# EAGLE design MATRIZ 8x8 (EAGLE 6.4)
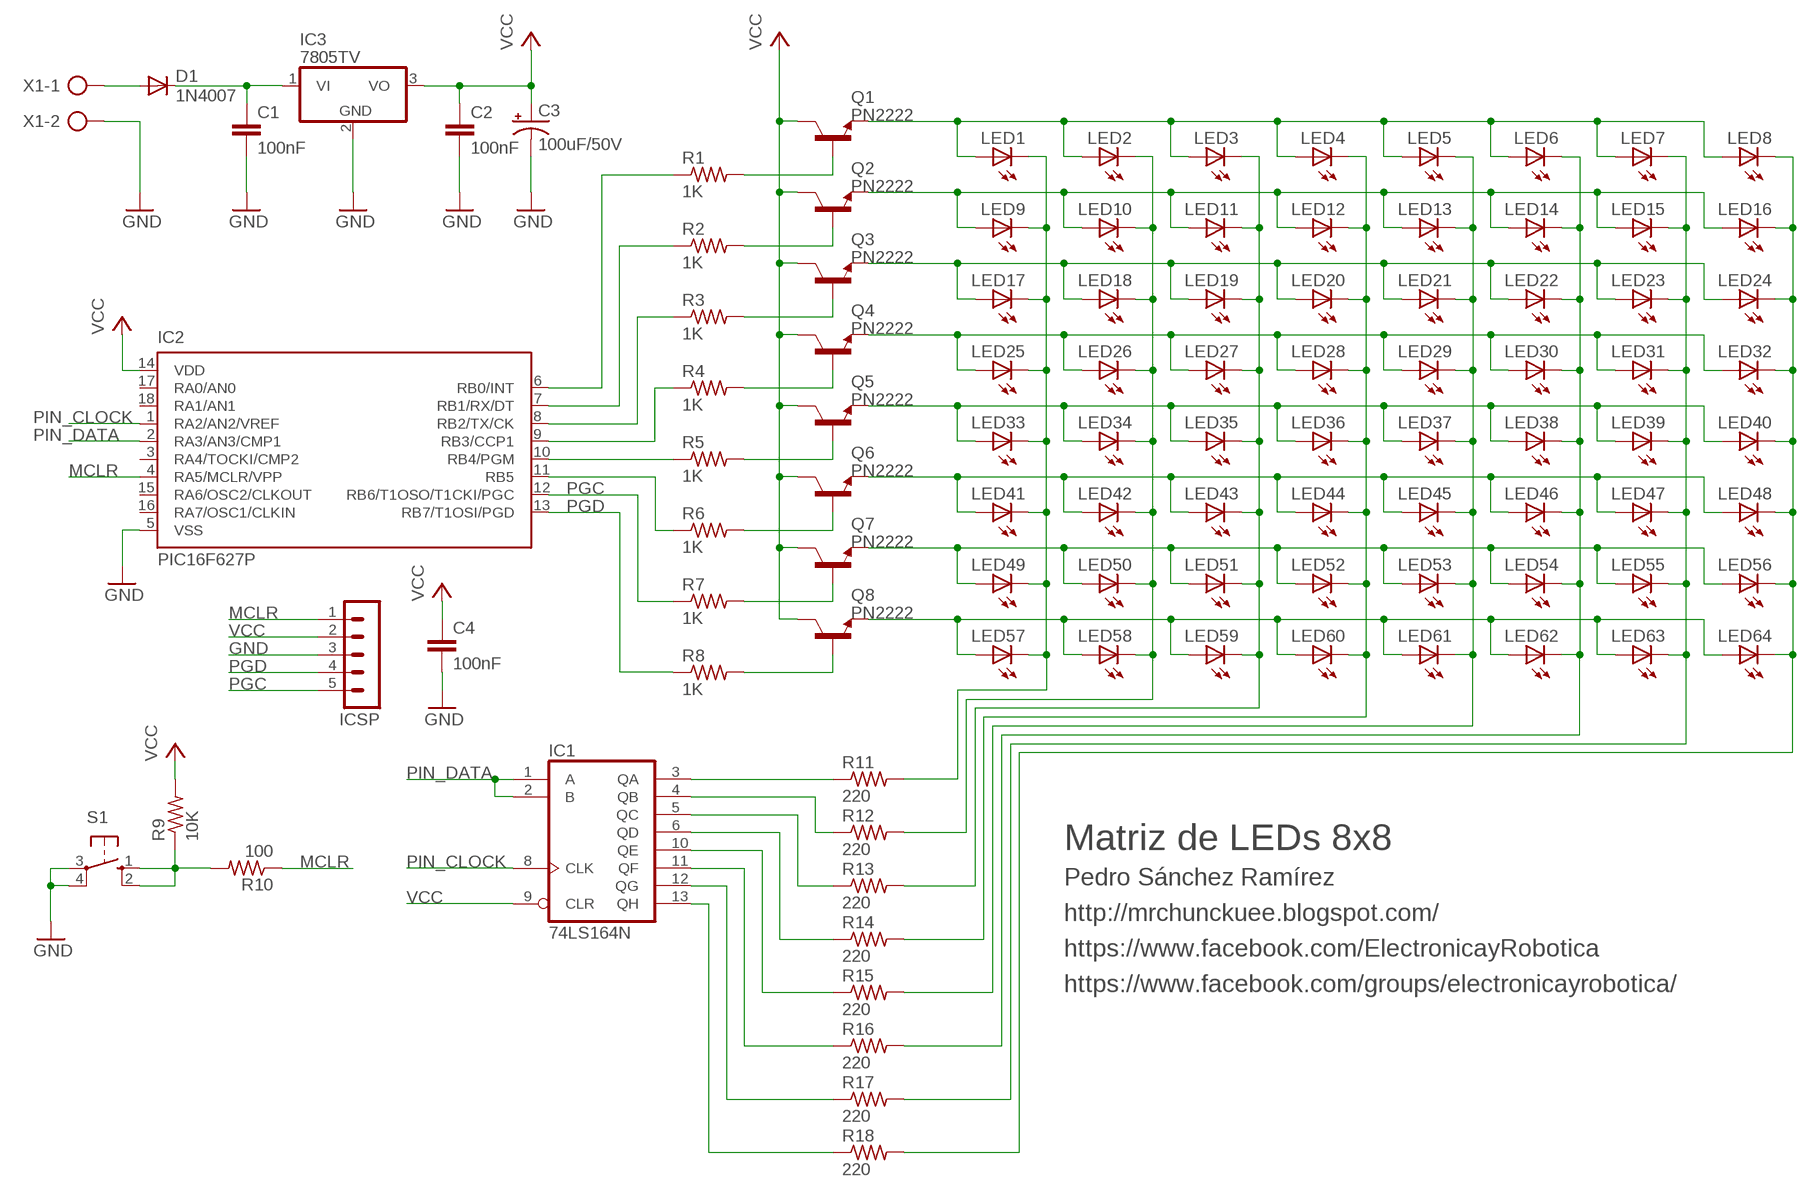
[diagram p0: schematic, sheet 1]

## Parts
C1  100nF  C-EU050-024X044  [C050-024X044]
C2  100nF  C-EU050-024X044  [C050-024X044]
C3  100uF/50V  CPOL-USE5-10.5  [E5-10,5]
C4  100nF  C-EU050-024X044  [C050-024X044]
D1  1N4007  1N4004  [DO41-10]
IC1  74LS164N  [DIL14]
IC2  PIC16F627P  [DIL18]
IC3  7805TV  [TO220V]
ICSP  MA05-1  [MA05-1]
LED1  LED5MM  [LED5MM]
LED2  LED5MM  [LED5MM]
LED3  LED5MM  [LED5MM]
LED4  LED5MM  [LED5MM]
LED5  LED5MM  [LED5MM]
LED6  LED5MM  [LED5MM]
LED7  LED5MM  [LED5MM]
LED8  LED5MM  [LED5MM]
LED9  LED5MM  [LED5MM]
LED10  LED5MM  [LED5MM]
LED11  LED5MM  [LED5MM]
LED12  LED5MM  [LED5MM]
LED13  LED5MM  [LED5MM]
LED14  LED5MM  [LED5MM]
LED15  LED5MM  [LED5MM]
LED16  LED5MM  [LED5MM]
LED17  LED5MM  [LED5MM]
LED18  LED5MM  [LED5MM]
LED19  LED5MM  [LED5MM]
LED20  LED5MM  [LED5MM]
LED21  LED5MM  [LED5MM]
LED22  LED5MM  [LED5MM]
LED23  LED5MM  [LED5MM]
LED24  LED5MM  [LED5MM]
LED25  LED5MM  [LED5MM]
LED26  LED5MM  [LED5MM]
LED27  LED5MM  [LED5MM]
LED28  LED5MM  [LED5MM]
LED29  LED5MM  [LED5MM]
LED30  LED5MM  [LED5MM]
LED31  LED5MM  [LED5MM]
LED32  LED5MM  [LED5MM]
LED33  LED5MM  [LED5MM]
LED34  LED5MM  [LED5MM]
LED35  LED5MM  [LED5MM]
LED36  LED5MM  [LED5MM]
LED37  LED5MM  [LED5MM]
LED38  LED5MM  [LED5MM]
LED39  LED5MM  [LED5MM]
LED40  LED5MM  [LED5MM]
LED41  LED5MM  [LED5MM]
LED42  LED5MM  [LED5MM]
LED43  LED5MM  [LED5MM]
LED44  LED5MM  [LED5MM]
LED45  LED5MM  [LED5MM]
LED46  LED5MM  [LED5MM]
LED47  LED5MM  [LED5MM]
LED48  LED5MM  [LED5MM]
LED49  LED5MM  [LED5MM]
LED50  LED5MM  [LED5MM]
LED51  LED5MM  [LED5MM]
LED52  LED5MM  [LED5MM]
LED53  LED5MM  [LED5MM]
LED54  LED5MM  [LED5MM]
LED55  LED5MM  [LED5MM]
LED56  LED5MM  [LED5MM]
LED57  LED5MM  [LED5MM]
LED58  LED5MM  [LED5MM]
LED59  LED5MM  [LED5MM]
LED60  LED5MM  [LED5MM]
LED61  LED5MM  [LED5MM]
LED62  LED5MM  [LED5MM]
LED63  LED5MM  [LED5MM]
LED64  LED5MM  [LED5MM]
Q1  PN2222  2N4124-NPN-TO92-EBC  [TO92-EBC]
Q2  PN2222  2N4124-NPN-TO92-EBC  [TO92-EBC]
Q3  PN2222  2N4124-NPN-TO92-EBC  [TO92-EBC]
Q4  PN2222  2N4124-NPN-TO92-EBC  [TO92-EBC]
Q5  PN2222  2N4124-NPN-TO92-EBC  [TO92-EBC]
Q6  PN2222  2N4124-NPN-TO92-EBC  [TO92-EBC]
Q7  PN2222  2N4124-NPN-TO92-EBC  [TO92-EBC]
Q8  PN2222  2N4124-NPN-TO92-EBC  [TO92-EBC]
R1  1K  R-US_0204/7  [0204/7]
R2  1K  R-US_0204/7  [0204/7]
R3  1K  R-US_0204/7  [0204/7]
R4  1K  R-US_0204/7  [0204/7]
R5  1K  R-US_0204/7  [0204/7]
R6  1K  R-US_0204/7  [0204/7]
R7  1K  R-US_0204/7  [0204/7]
R8  1K  R-US_0204/7  [0204/7]
R9  10K  R-US_0204/7  [0204/7]
R10  100  R-US_0204/7  [0204/7]
R11  220  R-US_0204/7  [0204/7]
R12  220  R-US_0204/7  [0204/7]
R13  220  R-US_0204/7  [0204/7]
R14  220  R-US_0204/7  [0204/7]
R15  220  R-US_0204/7  [0204/7]
R16  220  R-US_0204/7  [0204/7]
R17  220  R-US_0204/7  [0204/7]
R18  220  R-US_0204/7  [0204/7]
S1  10-XX  [B3F-10XX]
X1  AK500/2-H  [AK500/2-H]

## Nets
GND: C1.2 C2.2 C3.- C4.2 IC2.5(VSS) IC3.2(GND) ICSP.3 S1.3(P) S1.4(P1) X1.2
MCLR: IC2.4(RA5/MCLR/VPP) ICSP.1 R10.1
N$1: LED1.A LED2.A LED3.A LED4.A LED5.A LED6.A LED7.A LED8.A Q1.E
N$2: LED57.A LED58.A LED59.A LED60.A LED61.A LED62.A LED63.A LED64.A Q8.E
N$3: LED25.A LED26.A LED27.A LED28.A LED29.A LED30.A LED31.A LED32.A Q4.E
N$4: LED9.A LED10.A LED11.A LED12.A LED13.A LED14.A LED15.A LED16.A Q2.E
N$5: LED33.A LED34.A LED35.A LED36.A LED37.A LED38.A LED39.A LED40.A Q5.E
N$6: LED49.A LED50.A LED51.A LED52.A LED53.A LED54.A LED55.A LED56.A Q7.E
N$7: D1.A X1.1
N$8: LED17.A LED18.A LED19.A LED20.A LED21.A LED22.A LED23.A LED24.A Q3.E
N$9: LED41.A LED42.A LED43.A LED44.A LED45.A LED46.A LED47.A LED48.A Q6.E
N$17: Q1.B R1.2
N$18: Q8.B R8.2
N$19: Q7.B R7.2
N$20: Q6.B R6.2
N$21: Q5.B R5.2
N$22: Q4.B R4.2
N$23: Q2.B R2.2
N$24: Q3.B R3.2
N$25: IC2.8(RB2/TX/CK) R3.1
N$26: C1.1 D1.C IC3.1(VI)
N$28: IC2.9(RB3/CCP1) R4.1
N$29: IC2.10(RB4/PGM) R5.1
N$30: IC2.7(RB1/RX/DT) R2.1
N$31: IC2.6(RB0/INT) R1.1
N$32: IC2.11(RB5) R6.1
N$33: R9.1 R10.2 S1.1(S) S1.2(S1)
N$34: IC1.3(QA) R11.1
N$35: IC1.4(QB) R12.1
N$36: IC1.5(QC) R13.1
N$37: IC1.6(QD) R14.1
N$38: IC1.10(QE) R15.1
N$39: IC1.11(QF) R16.1
N$40: IC1.12(QG) R17.1
N$41: IC1.13(QH) R18.1
PGC: IC2.12(RB6/T1OSO/T1CKI/PGC) ICSP.5 R7.1
PGD: IC2.13(RB7/T1OSI/PGD) ICSP.4 R8.1
PIN_CLOCK: IC1.8(CLK) IC2.1(RA2/AN2/VREF)
PIN_DATA: IC1.1(A) IC1.2(B) IC2.2(RA3/AN3/CMP1)
QA: LED1.K(C) LED9.K(C) LED17.K(C) LED25.K(C) LED33.K(C) LED41.K(C) LED49.K(C) LED57.K(C) R11.2
QB: LED2.K(C) LED10.K(C) LED18.K(C) LED26.K(C) LED34.K(C) LED42.K(C) LED50.K(C) LED58.K(C) R12.2
QC: LED3.K(C) LED11.K(C) LED19.K(C) LED27.K(C) LED35.K(C) LED43.K(C) LED51.K(C) LED59.K(C) R13.2
QD: LED4.K(C) LED12.K(C) LED20.K(C) LED28.K(C) LED36.K(C) LED44.K(C) LED52.K(C) LED60.K(C) R14.2
QE: LED5.K(C) LED13.K(C) LED21.K(C) LED29.K(C) LED37.K(C) LED45.K(C) LED53.K(C) LED61.K(C) R15.2
QF: LED6.K(C) LED14.K(C) LED22.K(C) LED30.K(C) LED38.K(C) LED46.K(C) LED54.K(C) LED62.K(C) R16.2
QG: LED7.K(C) LED15.K(C) LED23.K(C) LED31.K(C) LED39.K(C) LED47.K(C) LED55.K(C) LED63.K(C) R17.2
QH: LED8.K(C) LED16.K(C) LED24.K(C) LED32.K(C) LED40.K(C) LED48.K(C) LED56.K(C) LED64.K(C) R18.2
VCC: C2.1 C3.+ C4.1 IC1.9(CLR) IC2.14(VDD) IC3.3(VO) ICSP.2 Q1.C Q2.C Q3.C Q4.C Q5.C Q6.C Q7.C Q8.C R9.2
Unconnected: IC2.3(RA4/TOCKI/CMP2) IC2.15(RA6/OSC2/CLKOUT) IC2.16(RA7/OSC1/CLKIN) IC2.17(RA0/AN0) IC2.18(RA1/AN1)

## Notes on the sheet
- Matriz de LEDs 8x8
- Pedro Sánchez Ramírez
- http://mrchunckuee.blogspot.com/
- https://www.facebook.com/ElectronicayRobotica
- https://www.facebook.com/groups/electronicayrobotica/

## Power pins joined to a net without a drawn wire
GND: IC1.7(GND)
VCC: IC1.14(VCC)

## Library data of the parts
C1 C2 C4 = rcl:C-EU: CAPACITOR, European symbol
C3 = rcl:CPOL-US: POLARIZED CAPACITOR, American symbol
D1 = diode:1N4004: DIODE general purpose rectifier, 1 A
IC1 = 74xx-us:74*164: 8-bit parallel out SHIFT REGISTER
IC2 = microchip:PIC16F62*: FLASH-Based 8-Bit CMOS Microcontroller Source: http://ww1.microchip.com/downloads/en/DeviceDoc/40300C.pdf; MF: MICROCHIP; MPN: PIC16F627-04/P; OC_FARNELL: 1084298; OC_NEWARK: 23C4960
IC3 = linear:78*: Positive VOLTAGE REGULATOR Source: http://cache.national.com/ds/LM/LM78L05.pdf http://www.fairchildsemi.com/ds/LM/LM7805.pdf
ICSP = con-lstb:MA05-1: PIN HEADER; OC_FARNELL: unknown; OC_NEWARK: unknown
LED1-LED64 = 1 MrChunckuee:LED: LED
Q1-Q8 = transistor-neu-to92:*-NPN-: NPN Transistror
R1-R18 = rcl:R-US_: RESISTOR, American symbol
S1 = switch-omron:10-XX: OMRON SWITCH; MPN: B3F-1000; OC_FARNELL: 176432; OC_NEWARK: 36M3542
X1 = con-ptr500:AK500/2-H: CONNECTOR Aug. 2004 / PTR Meßtechnik: Die Bezeichnung der Serie AK505 wurde geändert. Es handelt sich hierbei um AK500 in horizontaler Ausführung.; OC_FARNELL: unknown; OC_NEWARK: unknown

## Board
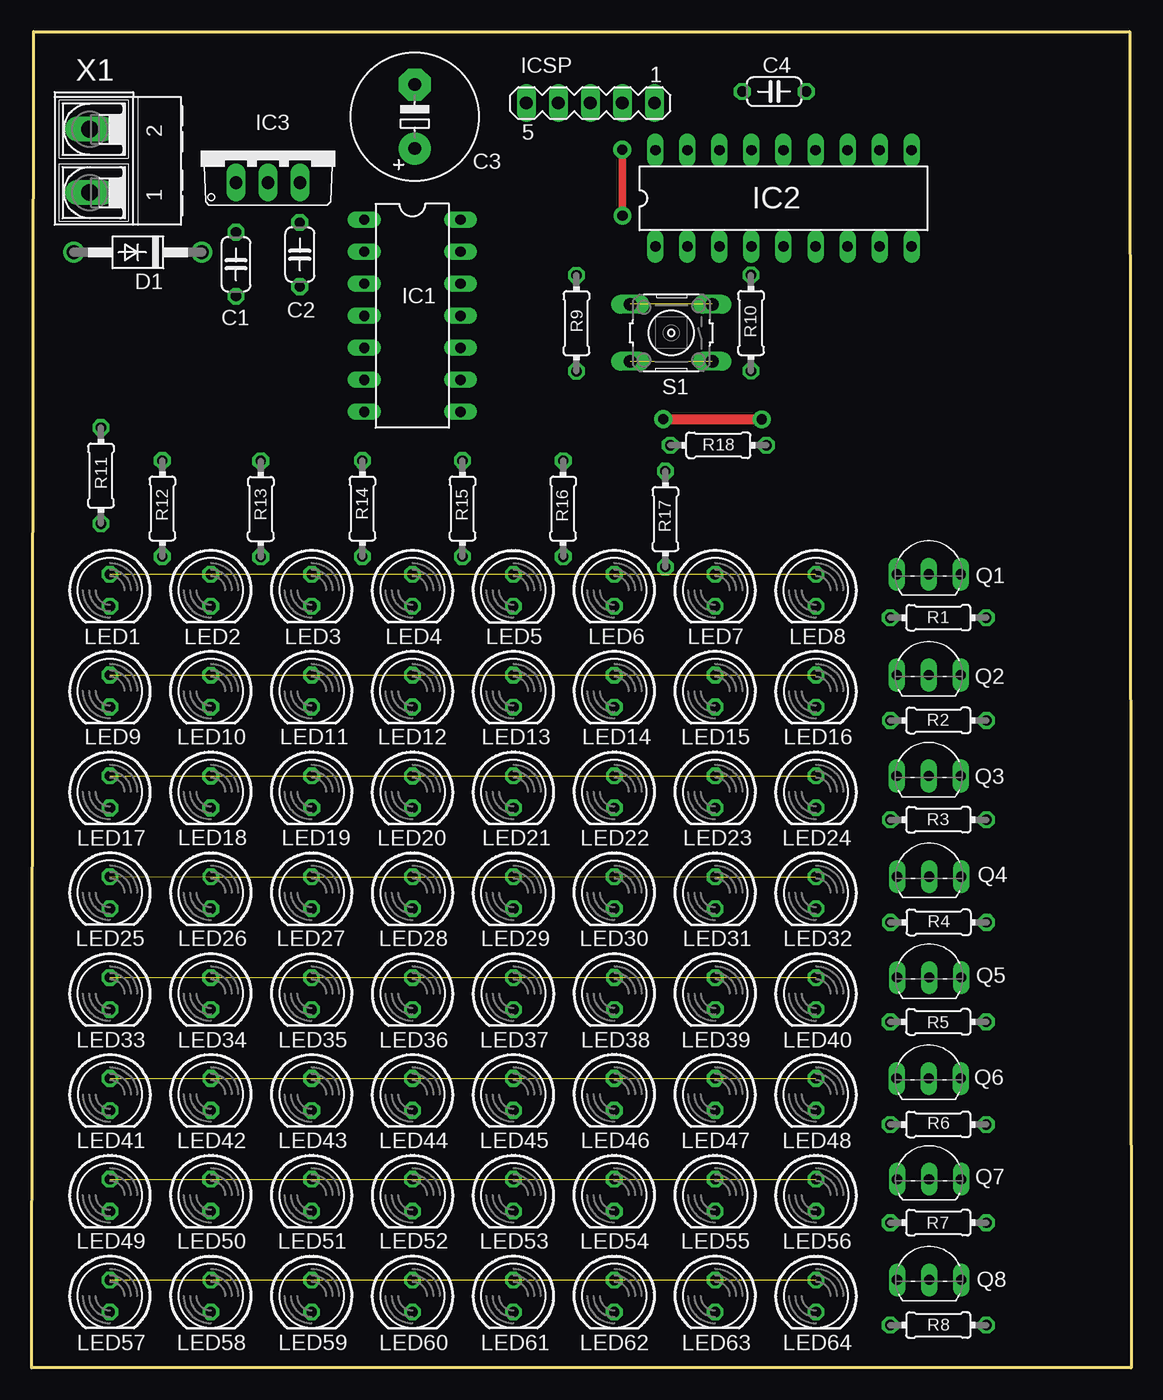
[diagram p1: board, top side]
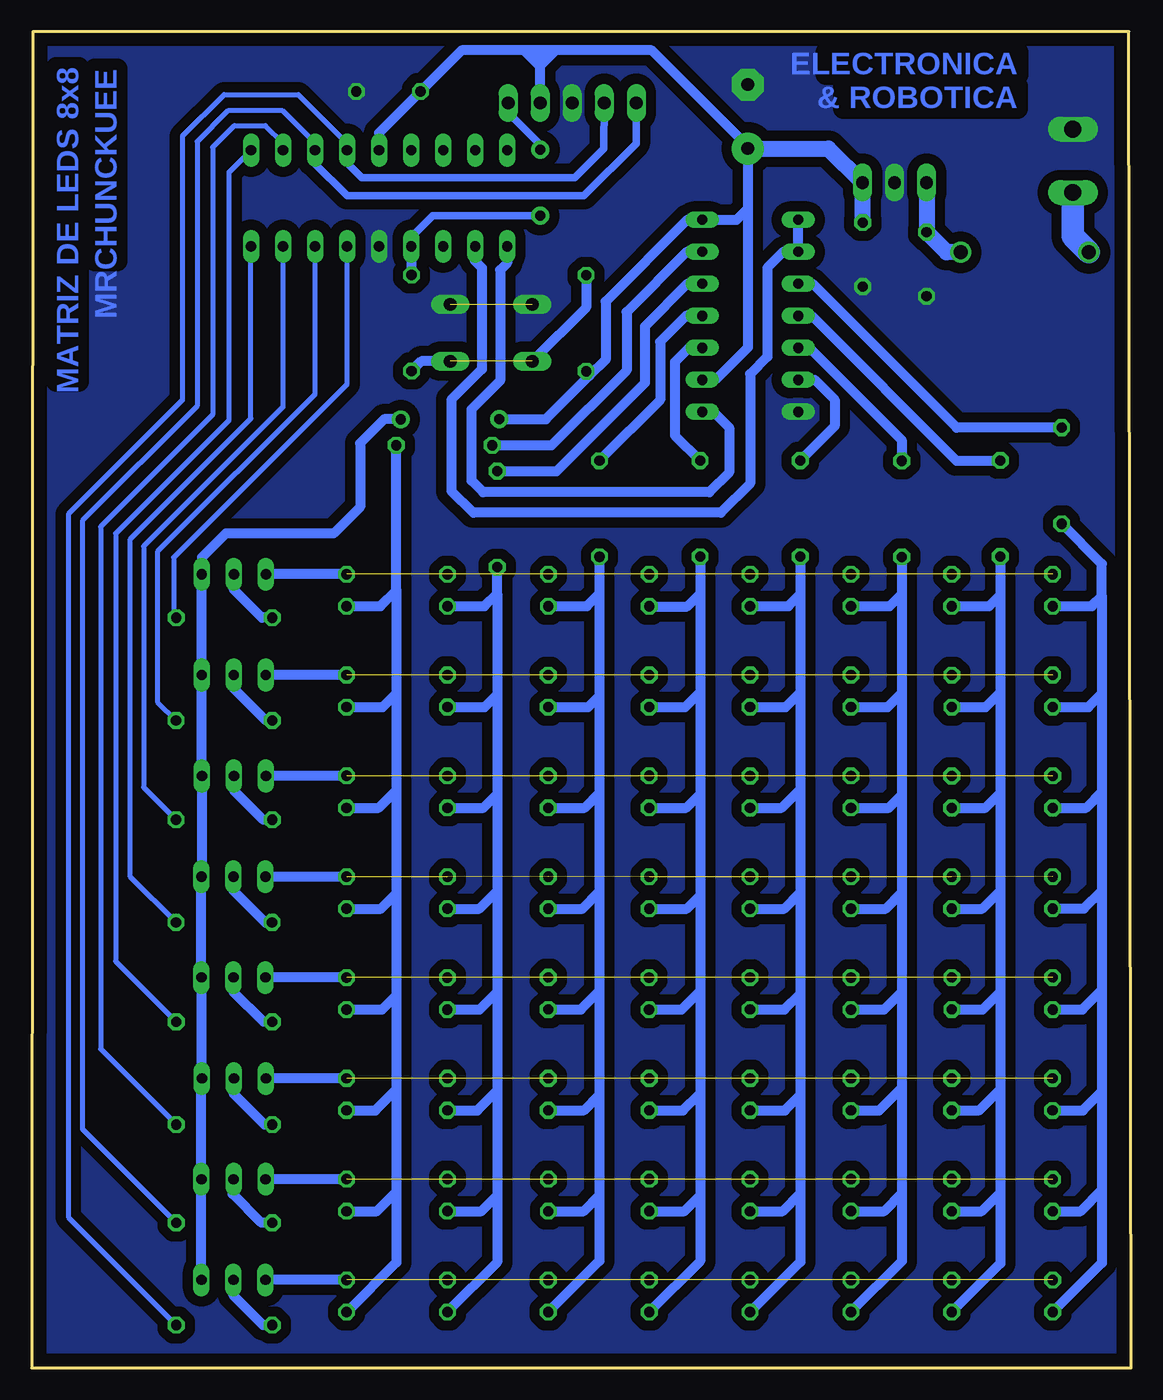
[diagram p2: board, bottom side, seen from below]

Size 87.21 x 106.04 mm. Coordinates in mm from the lower left corner, seen from the top.
Outline: 0.17,106.04 87.09,106.04 87.21,0 0,0 0.17,106.04
Copper layers (1*16): Top 0.035mm / dielectric 1.5mm / Bottom 0.035mm
Design rules "default": minimum track width 10mil, minimum drill 24mil, track to track 8mil, track to pad 8mil, pad to pad 8mil, via to via 8mil, smd to smd 8mil, copper to edge 40mil, drill to drill 8mil, minimum pad ring 10mil, minimum via ring 8mil, stop-mask expansion 4mil, vias tented up to drill 0mil, thermal gap 10mil

### Footprints (pad centres in the part's own frame; a part is rotated, then mirrored left to right if it is on the bottom)
C050-024X044 = drill 0.813 octagon: 1 -2.54,0; 2 2.54,0
E5-10,5 = drill 1.016 pad 2.54: + -2.54,0 | drill 1.016 pad 2.54 octagon: - 2.54,0
DO41-10 = drill 1.118: A 5.08,0; C -5.08,0
DIL14 = drill 0.813 long: 1 -7.62,-3.81; 2 -5.08,-3.81; 3 -2.54,-3.81; 4 0,-3.81; 5 2.54,-3.81; 6 5.08,-3.81; 7 7.62,-3.81; 8 7.62,3.81; 9 5.08,3.81; 10 2.54,3.81; 11 0,3.81; 12 -2.54,3.81; 13 -5.08,3.81; 14 -7.62,3.81
DIL18 = drill 0.813 long: 1 -10.16,-3.81; 2 -7.62,-3.81; 3 -5.08,-3.81; 4 -2.54,-3.81; 5 0,-3.81; 6 2.54,-3.81; 7 5.08,-3.81; 8 7.62,-3.81; 9 10.16,-3.81; 10 10.16,3.81; 11 7.62,3.81; 12 5.08,3.81; 13 2.54,3.81; 14 0,3.81; 15 -2.54,3.81; 16 -5.08,3.81; 17 -7.62,3.81; 18 -10.16,3.81
TO220V = drill 1.016 long: 1 -2.54,-2.54; 2 0,-2.54; 3 2.54,-2.54
MA05-1 = drill 1.016 long: 1 -5.08,0; 2 -2.54,0; 3 0,0; 4 2.54,0; 5 5.08,0
LED5MM = drill 0.813 octagon: A -1.27,0; K 1.27,0 | drill 0.6 octagon: A1 -1.27,0; K1 1.27,0
TO92-EBC = drill 0.813 long: B 0,-1.27; C 2.54,-1.27; E -2.54,-1.27
0204/7 = drill 0.813 octagon: 1 -3.81,0; 2 3.81,0
B3F-10XX = drill 1.016 long: 1 -3.251,2.261; 2 3.251,2.261; 3 -3.251,-2.261; 4 3.251,-2.261
AK500/2-H = drill 1.321 long: 1 -2.515,0; 2 2.515,0

### Placement (x,y rotation side)
C1  16.22,87.58 270 top
C2  21.28,88.34 270 top
C3  30.4,99.3 90 top
C4  58.91,101.27 0 top
D1  8.44,88.52 180 top
IC1  30.21,83.48 270 top
IC2  59.64,92.81 0 top
IC3  18.76,96.59 0 top
ICSP  44.32,100.37 180 top
LED1  6.22,61.71 270 top
LED2  14.22,61.71 270 top
LED3  22.22,61.71 270 top
LED4  30.22,61.71 270 top
LED5  38.22,61.71 270 top
LED6  46.22,61.71 270 top
LED7  54.22,61.71 270 top
LED8  62.22,61.71 270 top
LED9  6.22,53.71 270 top
LED10  14.22,53.71 270 top
LED11  22.22,53.71 270 top
LED12  30.21,53.71 270 top
LED13  38.22,53.71 270 top
LED14  46.22,53.71 270 top
LED15  54.22,53.71 270 top
LED16  62.22,53.71 270 top
LED17  6.22,45.71 270 top
LED18  14.22,45.71 270 top
LED19  22.22,45.71 270 top
LED20  30.22,45.7 270 top
LED21  38.22,45.71 270 top
LED22  46.22,45.71 270 top
LED23  54.22,45.71 270 top
LED24  62.22,45.71 270 top
LED25  6.22,37.72 270 top
LED26  14.22,37.71 270 top
LED27  22.22,37.71 270 top
LED28  30.22,37.71 270 top
LED29  38.22,37.71 270 top
LED30  46.22,37.71 270 top
LED31  54.22,37.71 270 top
LED32  62.22,37.71 270 top
LED33  6.22,29.71 270 top
LED34  14.22,29.71 270 top
LED35  22.22,29.71 270 top
LED36  30.22,29.71 270 top
LED37  38.23,29.71 270 top
LED38  46.22,29.71 270 top
LED39  54.23,29.71 270 top
LED40  62.22,29.71 270 top
LED41  6.22,21.7 270 top
LED42  14.22,21.71 270 top
LED43  22.22,21.7 270 top
LED44  30.22,21.71 270 top
LED45  38.22,21.71 270 top
LED46  46.22,21.71 270 top
LED47  54.22,21.71 270 top
LED48  62.22,21.71 270 top
LED49  6.22,13.71 270 top
LED50  14.22,13.71 270 top
LED51  22.22,13.71 270 top
LED52  30.22,13.71 270 top
LED53  38.22,13.71 270 top
LED54  46.22,13.71 270 top
LED55  54.22,13.71 270 top
LED56  62.22,13.71 270 top
LED57  6.21,5.71 270 top
LED58  14.22,5.71 270 top
LED59  22.22,5.71 270 top
LED60  30.22,5.71 270 top
LED61  38.22,5.71 270 top
LED62  46.22,5.71 270 top
LED63  54.22,5.71 270 top
LED64  62.22,5.71 270 top
Q1  71.16,64.24 0 top
Q2  71.16,56.25 0 top
Q3  71.15,48.24 0 top
Q4  71.19,40.25 0 top
Q5  71.19,32.25 0 top
Q6  71.15,24.24 0 top
Q7  71.19,16.25 0 top
Q8  71.19,8.26 0 top
R1  71.92,59.53 180 top
R2  71.93,51.37 180 top
R3  71.93,43.49 180 top
R4  71.94,35.35 180 top
R5  71.92,27.46 180 top
R6  71.92,19.32 180 top
R7  71.92,11.52 180 top
R8  71.92,3.4 180 top
R9  43.22,82.89 270 top
R10  57.06,82.91 270 top
R11  5.5,70.8 270 top
R12  10.37,68.19 270 top
R13  18.18,68.16 270 top
R14  26.24,68.18 270 top
R15  34.18,68.18 270 top
R16  42.17,68.18 270 top
R17  50.27,67.35 270 top
R18  54.48,73.21 0 top
S1  50.74,82.13 180 top
X1  4.62,95.77 90 top

### Tracks (layer width: path | path; a pad name or v marks a point on that pad's centre or on a via)
GND  (1 unrouted)
  pour Bottom (isolate 0.813, no thermals): -1.27,106.68 87.63,106.68 87.63,-1.27 -1.27,-1.27
MCLR  (via drill 0.8 pad 1.42)
  Top 0.61: v46.87,91.41 46.87,96.62 v46.85,96.65
  Bottom 0.61: v46.87,91.41 55.38,91.41 57.13,89.67 57.13,89.02 IC2.4 | v46.85,96.65 46.85,97.08 49.43,99.66 49.43,100.56 ICSP.1
  Bottom 0.813: 57.06,88.96 IC2.4 57.11,88.99 57.11,88.45 57.06,88.41 R10.1
N$1  (7 unrouted)
  Bottom 0.813: LED8.A Q1.E
N$2  (7 unrouted)
  Bottom 0.813: LED64.A Q8.E
N$3  (7 unrouted)
  Bottom 0.813: LED32.A Q4.E
N$4  (7 unrouted)
  Bottom 0.813: LED16.A Q2.E | Q2.E
N$5  (7 unrouted)
  Bottom 0.813: LED40.A Q5.E
N$6  (7 unrouted)
  Bottom 0.813: LED56.A Q7.E
N$7
  Bottom 1.778: X1.1 4.62,89.79 D1.A
N$8  (7 unrouted)
  Bottom 0.813: LED24.A 68.6,46.98 Q3.E
N$9  (7 unrouted)
  Bottom 0.813: LED48.A 68.61,22.98 Q6.E
N$17
  Bottom 0.813: R1.2 68.94,59.53 71.16,61.75 Q1.B
N$18
  Bottom 0.813: R8.2 68.83,3.4 71.2,5.77 71.2,6.98 Q8.B
N$19
  Bottom 0.813: R7.2 68.97,11.52 71.25,13.8 71.25,14.92 Q7.B
N$20
  Bottom 0.813: R6.2 68.74,19.32 71.16,21.74 Q6.B
N$21
  Bottom 0.813: R5.2 68.8,27.46 71.2,29.86 71.2,30.97 Q5.B
N$22
  Bottom 0.813: R4.2 68.67,35.35 71.2,37.89 71.2,38.97 Q4.B
N$23
  Bottom 0.813: R2.2 68.63,51.38 71.16,53.9 Q2.B
N$24
  Bottom 0.813: R3.2 68.82,43.49 71.16,45.83 Q3.B
N$25
  Bottom 0.406: R3.1 78.32,46.07 78.32,65.21 67.26,76.27 IC2.8 | IC2.8
N$26
  Bottom 1.27: IC3.1 C1.1 14.62,88.52 D1.C
N$28
  Bottom 0.406: R4.1 79.41,39.01 79.41,65.72 69.8,75.33 IC2.9 | IC2.9
N$29
  Bottom 0.406: R5.1 80.54,32.27 80.54,66.21 71.54,75.21 71.54,94.88 IC2.10
N$30
  Bottom 0.406: R2.1 77.22,52.85 77.22,64.77 64.72,77.27 IC2.7 | IC2.7
N$31
  Bottom 0.406: R1.1 75.95,59.74 75.95,64.3 62.18,78.07 IC2.6 | IC2.6
N$32
  Bottom 0.406: R6.1 81.72,25.31 81.72,66.76 72.85,75.63 72.85,96.84 71.12,98.57 68.65,98.57 67.29,97.2 67.29,96.65 IC2.11
N$33  (1 unrouted)
  Bottom 0.813: R9.1 43.22,84.14 S1.2 | S1.1 56.3,79.87 R10.2
N$34
  Bottom 0.813: IC1.3 25.26,86.02 13.84,74.61 R11.1
N$35
  Bottom 0.813: IC1.4 25.34,83.48 13.86,72 R12.1
N$36
  Bottom 0.813: IC1.5 25.5,80.94 18.19,73.63 R13.1
N$37
  Bottom 0.813: IC1.6 25.09,78.4 23.51,76.82 23.51,74.72 R14.1
N$38
  Bottom 0.813: IC1.10 35.06,80.94 36.18,79.83 36.18,73.99 R15.1
N$39
  Bottom 0.813: IC1.11 35.29,83.48 37.35,81.42 37.35,76.8 R16.1
N$40
  Bottom 0.813: IC1.12 35.19,86.02 38.57,82.64 38.57,78.16 45.57,71.16 R17.1
N$41
  Bottom 0.813: IC1.13 35.23,88.56 40.02,83.78 40.02,79.14 45.95,73.21 R18.1
PGC
  Bottom 0.406: R7.1 83.17,18.96 83.17,67.23 74.06,76.34 74.06,97.31 71.59,99.78 67.34,99.78 64.75,97.2
  Bottom 0.61: ICSP.5 39.26,97.15 43.4,93.02 62.18,93.02 64.81,95.64 64.81,96.53 IC2.12 64.75,96.65 64.75,97.2
PGD
  Bottom 0.406: R8.1 84.29,11.96 84.29,67.74 75.24,76.78 75.24,97.72 71.93,101.03 66.04,101.03 62.16,97.16 62.16,96.64 IC2.13
  Bottom 0.61: IC2.13 62.26,96.54 62.26,95.68 61,94.42 44.12,94.42 41.8,96.74 ICSP.4
PIN_CLOCK
  Bottom 0.813: IC1.8 33.12,75.86 31.88,74.62 31.88,71.04 33.44,69.49 51.39,69.49 52.3,70.4 52.3,76.06 50.03,78.32 50.03,87.12 49.48,87.67 IC2.1
PIN_DATA
  Bottom 0.813: IC1.1 IC1.2 27.57,88.56 28.84,87.29 28.84,80.23 30.21,78.86 30.21,70.18 32.54,67.85 52.17,67.85 53.91,69.59 53.91,76.83 51.5,79.24 51.5,87.3 52.02,87.83 IC2.2
QA
  Bottom 0.813: 2.32,61.23 2.32,53.52 | 2.32,53.52 2.32,45.69 | 2.32,45.69 2.32,37.87 | 2.32,37.87 2.32,29.98 | 2.32,29.98 2.32,21.95 | 2.32,21.95 2.32,14.13 | 2.32,14.13 2.32,8.34 LED57.K | LED1.K 3.1,60.44 2.32,61.23 | LED9.K 3.39,52.44 2.32,53.52 | LED17.K 3.57,44.44 2.32,45.69 | LED25.K 3.74,36.45 2.32,37.87 | LED33.K 3.86,28.44 2.32,29.98 | LED41.K 3.83,20.44 2.32,21.95 | LED49.K 4.01,12.44 2.32,14.13 | 2.32,61.23 2.32,63.8 R11.2
QB
  Bottom 0.813: R12.2 10.37,61.33 | 10.37,61.33 10.37,53.6 | 10.37,53.6 10.37,45.62 | 10.37,45.62 10.37,37.87 | 10.37,37.87 10.37,29.84 | 10.37,29.84 10.37,22.09 | 10.37,22.09 10.37,13.91 | 10.37,13.91 10.37,8.29 LED58.K | LED2.K 11.27,60.44 10.37,61.33 | LED10.K 11.53,52.44 10.37,53.6 | LED18.K 11.55,44.44 10.37,45.62 | LED26.K 11.8,36.44 10.37,37.87 | LED34.K 11.77,28.44 10.37,29.84 | LED42.K 12.02,20.44 10.37,22.09 | LED50.K 11.85,12.44 10.37,13.91
QC
  Bottom 0.813: R13.2 18.18,61.41 | 18.18,61.41 18.18,53.56 | 18.18,53.56 18.18,45.47 | 18.18,45.47 18.18,37.73 | 18.18,37.73 18.18,29.84 | 18.18,29.84 18.18,22.23 | 18.18,22.23 18.18,13.84 | 18.18,13.84 18.18,8.47 LED59.K | LED3.K 19.16,60.44 18.18,61.41 | LED11.K 19.3,52.44 18.18,53.56 | LED19.K 19.22,44.44 18.18,45.47 | LED27.K 19.47,36.44 18.18,37.73 | LED35.K 19.59,28.44 18.18,29.84 | LED43.K 19.98,20.43 18.18,22.23 | LED51.K 19.58,12.44 18.18,13.84
QD
  Bottom 0.813: R14.2 26.24,61.39 | 26.24,61.39 26.24,53.6 | 26.24,53.6 26.24,45.9 | 26.24,45.9 26.24,37.73 | 26.24,37.73 26.24,29.69 | 26.24,29.69 26.24,21.66 | 26.24,21.66 26.24,13.84 | 26.24,13.84 26.24,8.42 LED60.K | LED4.K 27.19,60.44 26.24,61.39 | LED12.K 27.39,52.44 26.24,53.6 | LED20.K 27.71,44.43 26.24,45.9 | LED28.K 27.52,36.44 26.24,37.73 | LED36.K 27.49,28.44 26.24,29.69 | LED44.K 27.46,20.44 26.24,21.66 | LED52.K 27.64,12.44 26.24,13.84
QE
  Bottom 0.813: R15.2 34.18,61.46 | 34.18,61.46 34.18,53.63 | 34.18,53.63 34.18,45.55 | 34.18,45.55 34.18,37.51 | 34.18,37.51 34.18,29.91 | 34.18,29.91 34.18,21.8 | 34.18,21.8 34.18,13.7 | 34.18,13.7 34.18,8.48 LED61.K | LED5.K 35.21,60.43 34.18,61.46 | LED13.K 35.38,52.44 34.18,53.63 | LED21.K 35.28,44.44 34.18,45.55 | LED29.K 35.25,36.44 34.18,37.51 | LED37.K 35.65,28.44 34.18,29.91 | LED45.K 35.54,20.44 34.18,21.8 | LED53.K 35.43,12.44 34.18,13.7
QF
  Bottom 0.813: R16.2 42.17,61.43 | 42.17,61.43 42.17,53.33 | 42.17,53.33 42.17,45.62 | 42.17,45.62 42.17,37.8 | 42.17,37.8 42.17,29.91 | 42.17,29.91 42.17,21.66 | 42.17,21.66 42.17,13.7 | 42.17,13.7 42.17,8.49 LED62.K | LED6.K 43.15,60.44 42.17,61.43 | LED14.K 43.06,52.44 42.17,53.33 | LED22.K 43.34,44.44 42.17,45.62 | LED30.K 43.52,36.44 42.17,37.8 | LED38.K 43.63,28.45 42.17,29.91 | LED46.K 43.38,20.44 42.17,21.66 | LED54.K 43.42,12.44 42.17,13.7
QG
  Bottom 0.813: 50.27,61.46 50.27,53.45 | 50.27,53.45 50.27,45.55 | 50.27,45.55 50.27,37.87 | 50.27,37.87 50.27,29.84 | 50.27,29.84 50.27,22.02 | 50.27,22.02 50.27,13.7 | 50.27,13.7 50.27,8.39 LED63.K | LED7.K 51.3,60.44 50.27,61.46 | LED15.K 51.28,52.44 50.27,53.45 | LED23.K 51.38,44.44 50.27,45.55 | LED31.K 51.71,36.44 50.27,37.87 | LED39.K 51.67,28.44 50.27,29.84 | LED47.K 51.85,20.44 50.27,22.02 | LED55.K 51.53,12.44 50.27,13.7 | 50.27,61.46 R17.2
QH
  Bottom 0.813: 58.28,61.69 58.28,53.52 | 58.28,53.52 58.28,45.83 | 58.28,45.83 58.28,37.65 | 58.28,37.65 58.28,29.55 | 58.28,29.55 58.28,22.09 | 58.28,22.09 58.28,13.98 | 58.28,13.98 58.28,8.38 LED64.K | LED8.K 59.54,60.44 58.28,61.69 | LED16.K 59.36,52.44 58.28,53.52 | LED24.K 59.67,44.44 58.28,45.83 | LED32.K 59.5,36.44 58.28,37.65 | LED40.K 59.39,28.44 58.28,29.55 | LED48.K 59.93,20.44 58.28,22.09 | LED56.K 59.82,12.44 58.28,13.98 | 58.28,61.69 R18.2
VCC  (via drill 0.8 pad 1.42)
  Top 0.813: v50.12,75.28 v57.91,75.28 v57.92,75.27
  Bottom 0.813: Q8.C Q7.C 73.73,22.94 Q6.C 73.69,30.95 Q5.C Q4.C 73.69,39.02 Q3.C 73.69,54.97 Q2.C Q1.C | IC2.14 59.64,98 C4.1 53.09,104.55 48.16,104.55 | 42.96,78.72 41.68,80 41.68,84.61 35.19,91.1 IC1.14 31.29,91.1 30.4,92 | 42.96,78.72 46.41,75.28 v50.12,75.28 | R9.2 43.22,78.98 42.96,78.72 | 73.72,62.99 Q1.C | 30.4,92 30.4,80.98 32.95,78.42 34,78.42 IC1.9 | v57.92,75.27 59.24,75.27 61.14,73.37 61.14,68.31 63.24,66.21 71.79,66.21 73.7,64.3 Q1.C | Q1.C | 30.4,92 C3.+ 30.4,96.98 30.46,96.98 38.03,104.55 45.65,104.55 | 45.65,104.55 47.02,104.55 | 47.02,104.55 48.16,104.55 | 46.86,103.33 45.65,104.55 | 46.86,103.25 48.16,104.55 | ICSP.2 46.86,104.4 47.02,104.55
  Bottom 1.27: C2.1 21.28,94.03 IC3.3 24,96.76 C3.+

### Text on the board
Bottom: ELECTRONICA | MATRIZ DE LEDS 8x8 | MRCHUNCKUEE | & ROBOTICA